# Altium schematic sheet HVD_Filtering.SchDoc: QUTMS Shutdown V2 - HVD_Filtering
size A4; Author: Jonn Dillon; Organization: QUT Motorsport; Address1: O-120; Address2: O Block; Address3: QUT Gardens Point; Address4: Brisbane, 4000; DocumentNumber: 5; SheetNumber: 5; SheetTotal: 13
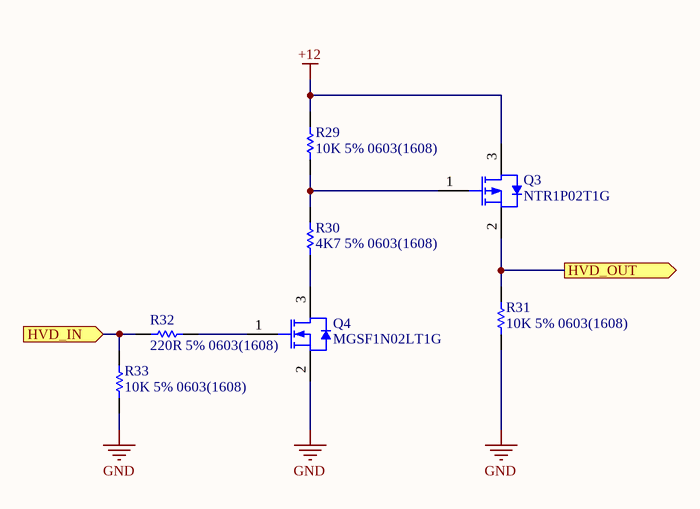
[diagram p0: HVD_Filtering.SchDoc]

## Parts
Q3  NTR1P02T1G  [ONSC-SOT-23-3-318-08_V]
Q4  MGSF1N02LT1G  [ONSC-SOT-23-3-318-08_V]
R29  10K 5% 0603(1608)  [RESC0603(1608)_N]
R30  4K7 5% 0603(1608)  [RESC0603(1608)_N]
R31  10K 5% 0603(1608)  [RESC0603(1608)_N]
R32  220R 5% 0603(1608)  [RESC0603(1608)_M]
R33  10K 5% 0603(1608)  [RESC0603(1608)_N]

## Ports
HVD_IN (in), HVD_OUT (out)

## Nets
+12: Q3.3(D) R29.2
GND: Q4.2(S) R31.1 R33.1
HVD_IN: R32.1 R33.2 ; port HVD_IN
HVD_OUT: Q3.2(S) R31.2 ; port HVD_OUT
NetQ3_1: Q3.1(G) R29.1 R30.2
NetQ4_1: Q4.1(G) R32.2
NetQ4_3: Q4.3(D) R30.1

## Notes on the sheet
- Title
- Size:
- Date:
- A4
- Number:
- Time:
- Revision:
- Sheet
- of
- File:

## Library data of the parts
Q3 = CMP-1058-00751-1: Power MOSFET, -20 V, -1 A, P-Channel, 3-Pin SOT-23, Pb-Free, Tape and Reel; Manufacturer: On Semiconductor; Ciss Typ (pF): 165; Coss Typ (pF): 110; Qrr Typ (nC): 8; Crss Typ (pF): 35; V(BR)DSS Min (V): 20; VGS(th) Max (V): 2.3; Configuration: Single; ID Max (A): 1; Channel Polarity: P Channel; PD Max (W): 0.4; ComponentLink2Description: Datasheet; ComponentLink3URL: http://www.onsemi.cn/pub_link/Collateral/318-08.PDF; PackageReference: SOT-23-3-318-08; ComponentLink1Description: Manufacturer URL; Mounting Technology: Surface Mount; RoHS: Pb-Free; Package Type: SOT-23-3; DatasheetVersion: Rev. 7; PackageVersion: Rev. AP, 11/2009; Packing: Tape and Reel; PackageDescription: 3-Pin Small Outline Transistor, Body 2.92 x 1.3 mm, Pitch 0.95 mm; VGS Max (V): 20; ComponentLink3Description: Package Specification; ComponentLink1URL: http://www.onsemi.com/; PartNumber: NTR1P02T1G; ComponentLink2URL: http://www.onsemi.cn/pub_link/Collateral/NTR1P02T1-D.PDF
Q4 = CMP-1058-00777-1: Power MOSFET, 750 mA, 20 V, N-Channel, 3-Pin SOT-23, Pb-Free, Tape and Reel; Manufacturer: On Semiconductor; Crss Typ (pF): 45; Ciss Typ (pF): 125; VGS(th) Max (V): 2.4; Coss Typ (pF): 120; PD Max (W): 0.4; VGS Max (V): 20; Configuration: Single; Channel Polarity: N Channel; ID Max (A): 0.75; PackageReference: SOT-23-3-318-08; ComponentLink2Description: Datasheet; PackageVersion: Rev. AP, 11/2009; ComponentLink1URL: http://www.onsemi.com/; RoHS: Pb-Free; Mounting Technology: Surface Mount; Package Type: SOT-23-3; ComponentLink1Description: Manufacturer URL; V(BR)DSS Min (V): 20; PackageDescription: 3-Pin Small Outline Transistor, Body 2.92 x 1.3 mm, Pitch 0.95 mm; Packing: Tape and Reel; PartNumber: MGSF1N02LT1G; DatasheetVersion: Rev. 6; ComponentLink2URL: http://www.onsemi.cn/pub_link/Collateral/MGSF1N02LT1-D.PDF; ComponentLink3URL: http://www.onsemi.cn/pub_link/Collateral/318-08.PDF; ComponentLink3Description: Package Specification
R29 R31 R33 = CMP-1012-00098-1: 10K 0.1W 5% 0603 (1608 Metric)  SMD; Case-EIA: 0603; Value: 10000.00 Ohm; Case-Metric: 1608; Technology: SMT; Tolerance: 5 %; Power: 0.1 W
R30 = CMP-1012-00090-1: 4K7 0.1W 5% 0603 (1608 Metric)  SMD; Case-Metric: 1608; Value: 4700.00 Ohm; Case-EIA: 0603; Tolerance: 5 %; Technology: SMT; Power: 0.1 W
R32 = CMP-1012-00058-1: 220R 0.1W 5% 0603 (1608 Metric)  SMD; Case-EIA: 0603; Case-Metric: 1608; Value: 220.00 Ohm; Technology: SMT; Power: 0.1 W; Tolerance: 5 %